# Altium schematic sheet mcu.SchDoc
size A4
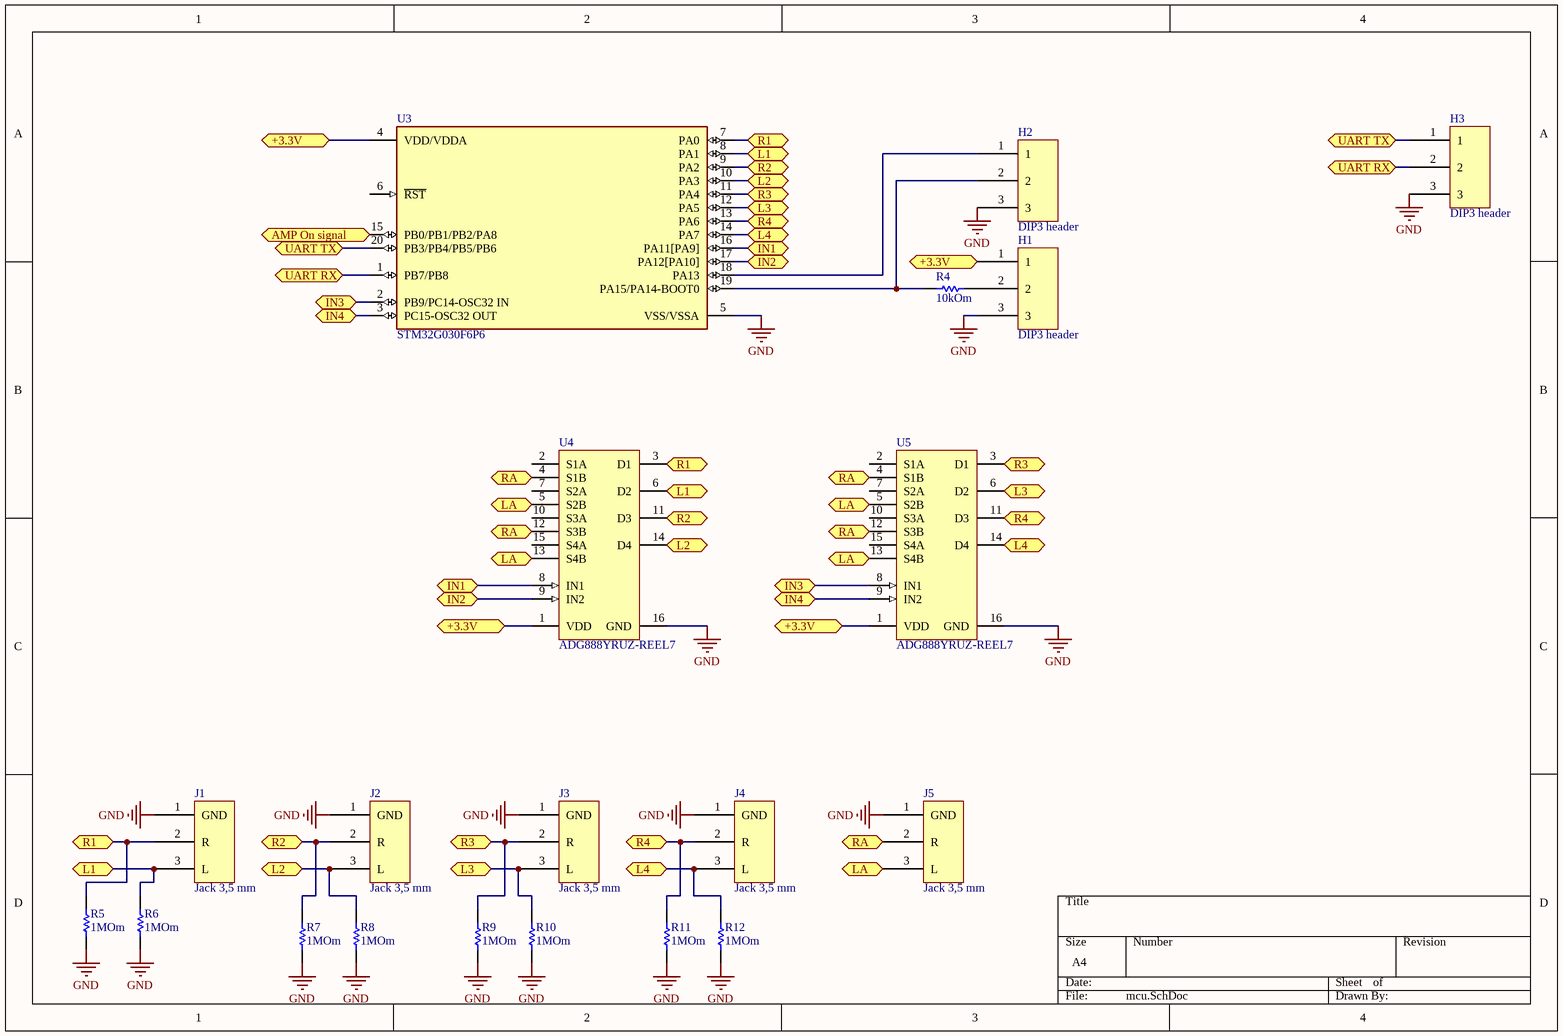
[diagram p0: mcu.SchDoc]

## Parts
H1  DIP3 header  [DIP3]
H2  DIP3 header  [DIP3]
H3  DIP3 header  [DIP3]
J1  Jack 3,5 mm  [jack 3,5mm]
J2  Jack 3,5 mm  [jack 3,5mm]
J3  Jack 3,5 mm  [jack 3,5mm]
J4  Jack 3,5 mm  [jack 3,5mm]
J5  Jack 3,5 mm  [jack 3,5mm]
R4  10kOm  [RESC1608X55X30ML20T10]
R5  1MOm  [RESC1608X55X30ML20T10]
R6  1MOm  [RESC1608X55X30ML20T10]
R7  1MOm  [RESC1608X55X30ML20T10]
R8  1MOm  [RESC1608X55X30ML20T10]
R9  1MOm  [RESC1608X55X30ML20T10]
R10  1MOm  [RESC1608X55X30ML20T10]
R11  1MOm  [RESC1608X55X30ML20T10]
R12  1MOm  [RESC1608X55X30ML20T10]
U3  STM32G030F6P6  [FP-TSSOP20-YA-MFG]
U4  ADG888YRUZ-REEL7  [ADI-RU-16_N]
U5  ADG888YRUZ-REEL7  [ADI-RU-16_N]

## Ports
+3.3V (bidir), AMP On signal (bidir), IN1 (bidir), IN2 (bidir), IN3 (bidir), IN4 (bidir), L1 (bidir), L2 (bidir), L3 (bidir), L4 (bidir), LA (bidir), R1 (bidir), R2 (bidir), R3 (bidir), R4 (bidir), RA (bidir), UART RX (bidir), UART TX (bidir)

## Nets
GND: H1.3 H2.3 H3.3 J1.1(GND) J2.1(GND) J3.1(GND) J4.1(GND) J5.1(GND) R5.1 R6.1 R7.1 R8.1 R9.1 R10.1 R11.1 R12.1 U3.5(VSS/VSSA) U4.16(GND) U5.16(GND)
+3.3V: H1.1 U3.4(VDD/VDDA) U4.1(VDD) U5.1(VDD) ; port +3.3V
AMP On signal: U3.15(PB0/PB1/PB2/PA8) ; port AMP On signal
IN1: U3.16(PA11[PA9]) U4.8(IN1) ; port IN1
IN2: U3.17(PA12[PA10]) U4.9(IN2) ; port IN2
IN3: U3.2(PB9/PC14-OSC32_IN) U5.8(IN1) ; port IN3
IN4: U3.3(PC15-OSC32_OUT) U5.9(IN2) ; port IN4
L1: J1.3(L) R6.2 U3.8(PA1) U4.6(D2) ; port L1
L2: J2.3(L) R8.2 U3.10(PA3) U4.14(D4) ; port L2
L3: J3.3(L) R10.2 U3.12(PA5) U5.6(D2) ; port L3
L4: J4.3(L) R12.2 U3.14(PA7) U5.14(D4) ; port L4
LA: J5.3(L) U4.5(S2B) U4.13(S4B) U5.5(S2B) U5.13(S4B) ; port LA
R1: J1.2(R) R5.2 U3.7(PA0) U4.3(D1) ; port R1
R2: J2.2(R) R7.2 U3.9(PA2) U4.11(D3) ; port R2
R3: J3.2(R) R9.2 U3.11(PA4) U5.3(D1) ; port R3
R4: J4.2(R) R11.2 U3.13(PA6) U5.11(D3) ; port R4
RA: J5.2(R) U4.4(S1B) U4.12(S3B) U5.4(S1B) U5.12(S3B) ; port RA
UART RX: H3.2 U3.1(PB7/PB8) ; port UART RX
UART TX: H3.1 U3.20(PB3/PB4/PB5/PB6) ; port UART TX
NetH1_2: H1.2 R4.2
NetH2_1: H2.1 U3.18(PA13)
NetH2_2: H2.2 R4.1 U3.19(PA15/PA14-BOOT0)

Not connected (* = marked no-connect by the designer): U3 6(~{RST}); U4 2(S1A) 7(S2A) 10(S3A) 15(S4A); U5 2(S1A) 7(S2A) 10(S3A) 15(S4A)

## Library data of the parts
R4-R12 = CMP-2000-01555-1: Part Number: RK73H1JTTD5101F; Manufacturer: KOA Speer
U3 = CMP-12105-000034-1: ARM MICROCONTROLLERS - MCU; Manufacturer: STMicroelectronics; Max Supply Voltage: 3.6V; Interface: I2C,SPI,USART,LIN,IrDA,I2S,SMBus; Memory Size: 32KBytes; Number Of I/Os: 17; Number Of Timers/Counters: 6; Core Architecture: ARM Cortex-M0+; Number Of Pwm Channels: 11; Standoff Height: 0.05mm; Number Of A/D Converters: 1; Number Of I2C Channels: 2; Data Bus Width: 32bits; Ram Size: 8KBytes; Max Junction Temp: +105°C; Number Of Spi Channels: 3; Min Supply Voltage: 2V; Number Of Adc Channels: 16; Memory Type: FLASH; Frequency: 64MHz; Ambient Temperature Range Low: -40°C; ComponentLink2URL: https://www.st.com/resource/en/datasheet/stm32g030f6.pdf; Temperature Range Low: -40°C; Automotive: No; Device Class L1: Integrated Circuits (ICs); Category: IC; Temperature Range High: +85°C; ComponentLink2Description: Datasheet; Device Class L2: Embedded Processors and Controllers; Manufacturer Part Number: STM32G030F6P6; Height: 1.2mm; Ambient Temperature Range High: +85°C; Octopart: https://octopart.com/stm32g030f6p6-stmicroelectronics-103773023; Package: TSSOP20-YA; Temperature: -40°C to +85°C; Lead Free: Yes; Device Class L3: Microcontrollers; Number Of Uart Channels: 2; RoHS: TRUE; Number Of Cores: 1; Digikey Description: ARM MICROCONTROLLERS - MCU
U4 U5 = CMP-0790-00216-1: 0.4 Ohm CMOS, Dual DPDT Switches, -40 to 125 degC, 16-pin SOP (RU-16), Reel; Manufacturer: Analog Devices; Id, Is (ON): 200pA, 200pA, 200pA; Ron (ohms): 0.4; # Sw Functions: 2; Configuration: SPDT; Power Dissipation: 20uW; Max Pos Supply: 5.5V; Min Pos Supply: 1.8V; ComponentLink3URL: http:/www.analog.com/static/imported-files/packages/36244347913743854010197452789RU16.pdf; ComponentLink1URL: http://www.analog.com/en/index.html; Mounting Technology: Surface Mount; Is OFF: 200pA, 200pA, 200pA; PackageReference: RU-16; PartNumber: ADG888YRUZ-REEL7; ComponentLink1Description: Manufacturer URL; ComponentLink3Description: Package Specification; ComponentLink2Description: Datasheet; ComponentLink2URL: http://www.analog.com/static/imported-files/data_sheets/ADG888.pdf; Packing: Reel; PackageVersion: Nov-02; DatasheetVersion: Rev. A; Code_JEDEC: MO-153AB; PackageDescription: 16-Pin Thin Shrink Small Outline Package, Body 5 x 4.4 mm, Pitch 0.65 mm
J1-J5 = Jack 3,5 mm: ComponentLink1Description: https://lcsc.com/product-detail/Audio-Video-Connectors_BOOMELE-Boom-Precision-Elec-PJ-307C_C16684.html; ComponentLink1URL: *